# EAGLE schematic StromlaufplanLED (EAGLE 9.7.0)
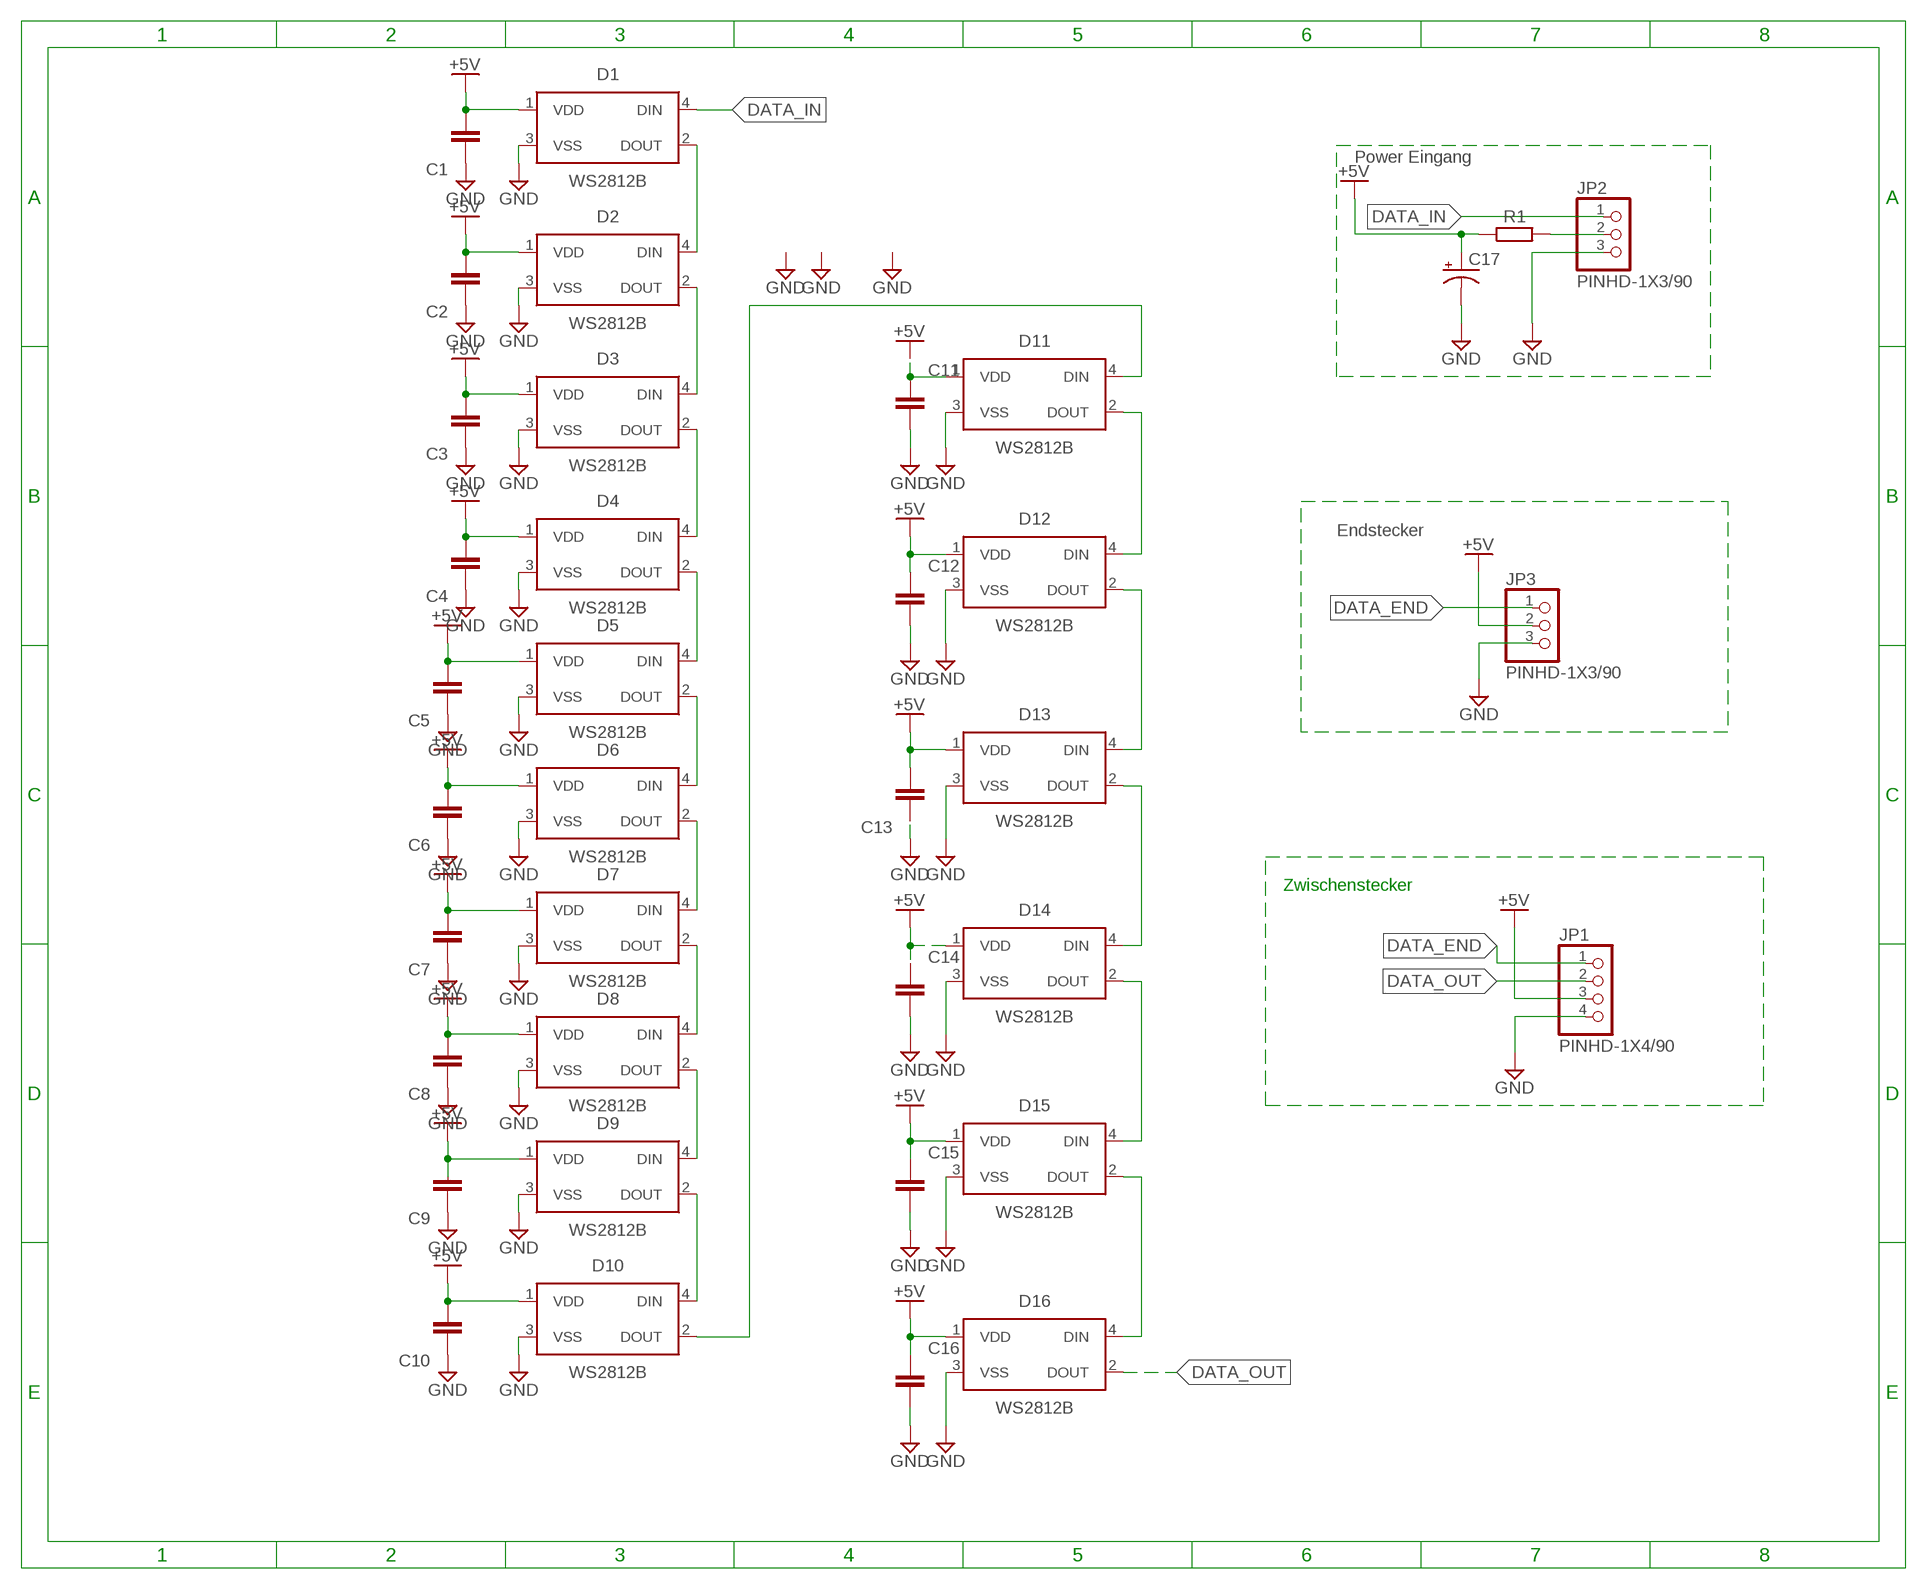
[diagram p0: schematic, sheet 1]

## Parts
C1  C_CHIP-1206(3216-METRIC)  [CAPC3216X135]
C2  C_CHIP-1206(3216-METRIC)  [CAPC3216X135]
C3  C_CHIP-1206(3216-METRIC)  [CAPC3216X135]
C4  C_CHIP-1206(3216-METRIC)  [CAPC3216X135]
C5  C_CHIP-1206(3216-METRIC)  [CAPC3216X135]
C6  C_CHIP-1206(3216-METRIC)  [CAPC3216X135]
C7  C_CHIP-1206(3216-METRIC)  [CAPC3216X135]
C8  C_CHIP-1206(3216-METRIC)  [CAPC3216X135]
C9  C_CHIP-1206(3216-METRIC)  [CAPC3216X135]
C10  C_CHIP-1206(3216-METRIC)  [CAPC3216X135]
C11  C_CHIP-1206(3216-METRIC)  [CAPC3216X135]
C12  C_CHIP-1206(3216-METRIC)  [CAPC3216X135]
C13  C_CHIP-1206(3216-METRIC)  [CAPC3216X135]
C14  C_CHIP-1206(3216-METRIC)  [CAPC3216X135]
C15  C_CHIP-1206(3216-METRIC)  [CAPC3216X135]
C16  C_CHIP-1206(3216-METRIC)  [CAPC3216X135]
C17  C-POL-US_TANTALUM-1206(3216-METRIC)  [CAPMP3216X180N]
D1  WS2812B  [WS2812B]
D2  WS2812B  [WS2812B]
D3  WS2812B  [WS2812B]
D4  WS2812B  [WS2812B]
D5  WS2812B  [WS2812B]
D6  WS2812B  [WS2812B]
D7  WS2812B  [WS2812B]
D8  WS2812B  [WS2812B]
D9  WS2812B  [WS2812B]
D10  WS2812B  [WS2812B]
D11  WS2812B  [WS2812B]
D12  WS2812B  [WS2812B]
D13  WS2812B  [WS2812B]
D14  WS2812B  [WS2812B]
D15  WS2812B  [WS2812B]
D16  WS2812B  [WS2812B]
JP1  PINHD-1X4/90  [1X04/90]
JP2  PINHD-1X3/90  [1X03/90]
JP3  PINHD-1X3/90  [1X03/90]
R1  R_CHIP-1206(3216-METRIC)  [RESC3216X70]

## Nets
+5V: C1.2 C2.2 C3.2 C4.2 C5.2 C6.2 C7.2 C8.2 C9.2 C10.2 C11.1 C12.1 C13.2 C14.1 C15.1 C16.1 C17.1(+) D1.1(VDD) D2.1(VDD) D3.1(VDD) D4.1(VDD) D5.1(VDD) D6.1(VDD) D7.1(VDD) D8.1(VDD) D9.1(VDD) D10.1(VDD) D11.1(VDD) D12.1(VDD) D13.1(VDD) D14.1(VDD) D15.1(VDD) D16.1(VDD) JP1.3 JP3.2 R1.1
DATA_END: JP1.1 JP3.1
DATA_IN: D1.4(DIN) JP2.1
DATA_OUT: D16.2(DOUT) JP1.2
GND: C1.1 C2.1 C3.1 C4.1 C5.1 C6.1 C7.1 C8.1 C9.1 C10.1 C11.2 C12.2 C13.1 C14.2 C15.2 C16.2 C17.2(-) D1.3(VSS) D2.3(VSS) D3.3(VSS) D4.3(VSS) D5.3(VSS) D6.3(VSS) D7.3(VSS) D8.3(VSS) D9.3(VSS) D10.3(VSS) D11.3(VSS) D12.3(VSS) D13.3(VSS) D14.3(VSS) D15.3(VSS) D16.3(VSS) JP1.4 JP2.3 JP3.3
N$1: D14.2(DOUT) D15.4(DIN)
N$2: D15.2(DOUT) D16.4(DIN)
N$4: JP2.2 R1.2
N$5: D2.2(DOUT) D3.4(DIN)
N$6: D3.2(DOUT) D4.4(DIN)
N$7: D4.2(DOUT) D5.4(DIN)
N$8: D5.2(DOUT) D6.4(DIN)
N$9: D6.2(DOUT) D7.4(DIN)
N$10: D7.2(DOUT) D8.4(DIN)
N$11: D8.2(DOUT) D9.4(DIN)
N$12: D9.2(DOUT) D10.4(DIN)
N$13: D10.2(DOUT) D11.4(DIN)
N$14: D11.2(DOUT) D12.4(DIN)
N$15: D12.2(DOUT) D13.4(DIN)
N$16: D13.2(DOUT) D14.4(DIN)
N$19: D1.2(DOUT) D2.4(DIN)

## Notes on the sheet
- Power Eingang
- Endstecker
- Zwischenstecker

## Library data of the parts
C1-C16 = Capacitor:C: Capacitor - Generic; CATEGORY: Capacitor
C17 = Capacitor:C-POL-US: Capacitor Polarised - ANSI; CATEGORY: Capacitor
D1-D16 = LED:WS2812B: Intelligent control LED integrated light source Datasheet <http://cdn.sparkfun.com/datasheets/BreakoutBoards/WS2812B.pdf>; CATEGORY: LED; COLOR: RGB; DESCRIPTION: LED integrated light source; MANUFACTURER: Worldsemi; MPN: WS2812B; OPERATING_TEMP: -25 ℃ to +80℃(TJ); PART_STATUS: Active; SUB_CATEGORY: RGB
JP1 = Connector:PINHD-1X4: PIN HEADER; CATEGORY: Headers; DESCRIPTION: Header, Right Angle, 4 Position; MANUFACTURER: Generic; MPN: Generic; OPERATING_TEMPERATURE: Generic; PART_STATUS: Active; PITCH: 0.100" (2.54mm); ROHS_COMPLIANCE: Generic; SERIES: Generic; SUB-CATEGORY: Headers, Male Pins; TYPE: Board to Board or Cable, Unshrouded, Through Hole, Right Angle
JP2 JP3 = Connector:PINHD-1X3: PIN HEADER; CATEGORY: Headers; DESCRIPTION: Header, Right Angle, 3 Position; MANUFACTURER: Generic; MPN: Generic; OPERATING_TEMPERATURE: Generic; PART_STATUS: Active; PITCH: 0.100" (2.54mm); ROHS_COMPLIANCE: Generic; SERIES: Generic; SUB-CATEGORY: Headers, Male Pins; TYPE: Board to Board or Cable, Unshrouded, Through Hole, Right Angle
R1 = Resistor:R: Resistor Fixed - Generic; CATEGORY: Resistor; SUB-CATEGORY: Fixed